# EAGLE design XMICRO-MEMORY V1.0 (EAGLE 6.3)
PROJECT_NAME: XMICRO-MEMORY; PROJECT_REVISION: 1.0

## Sheet 1 of 3: Bus Interface
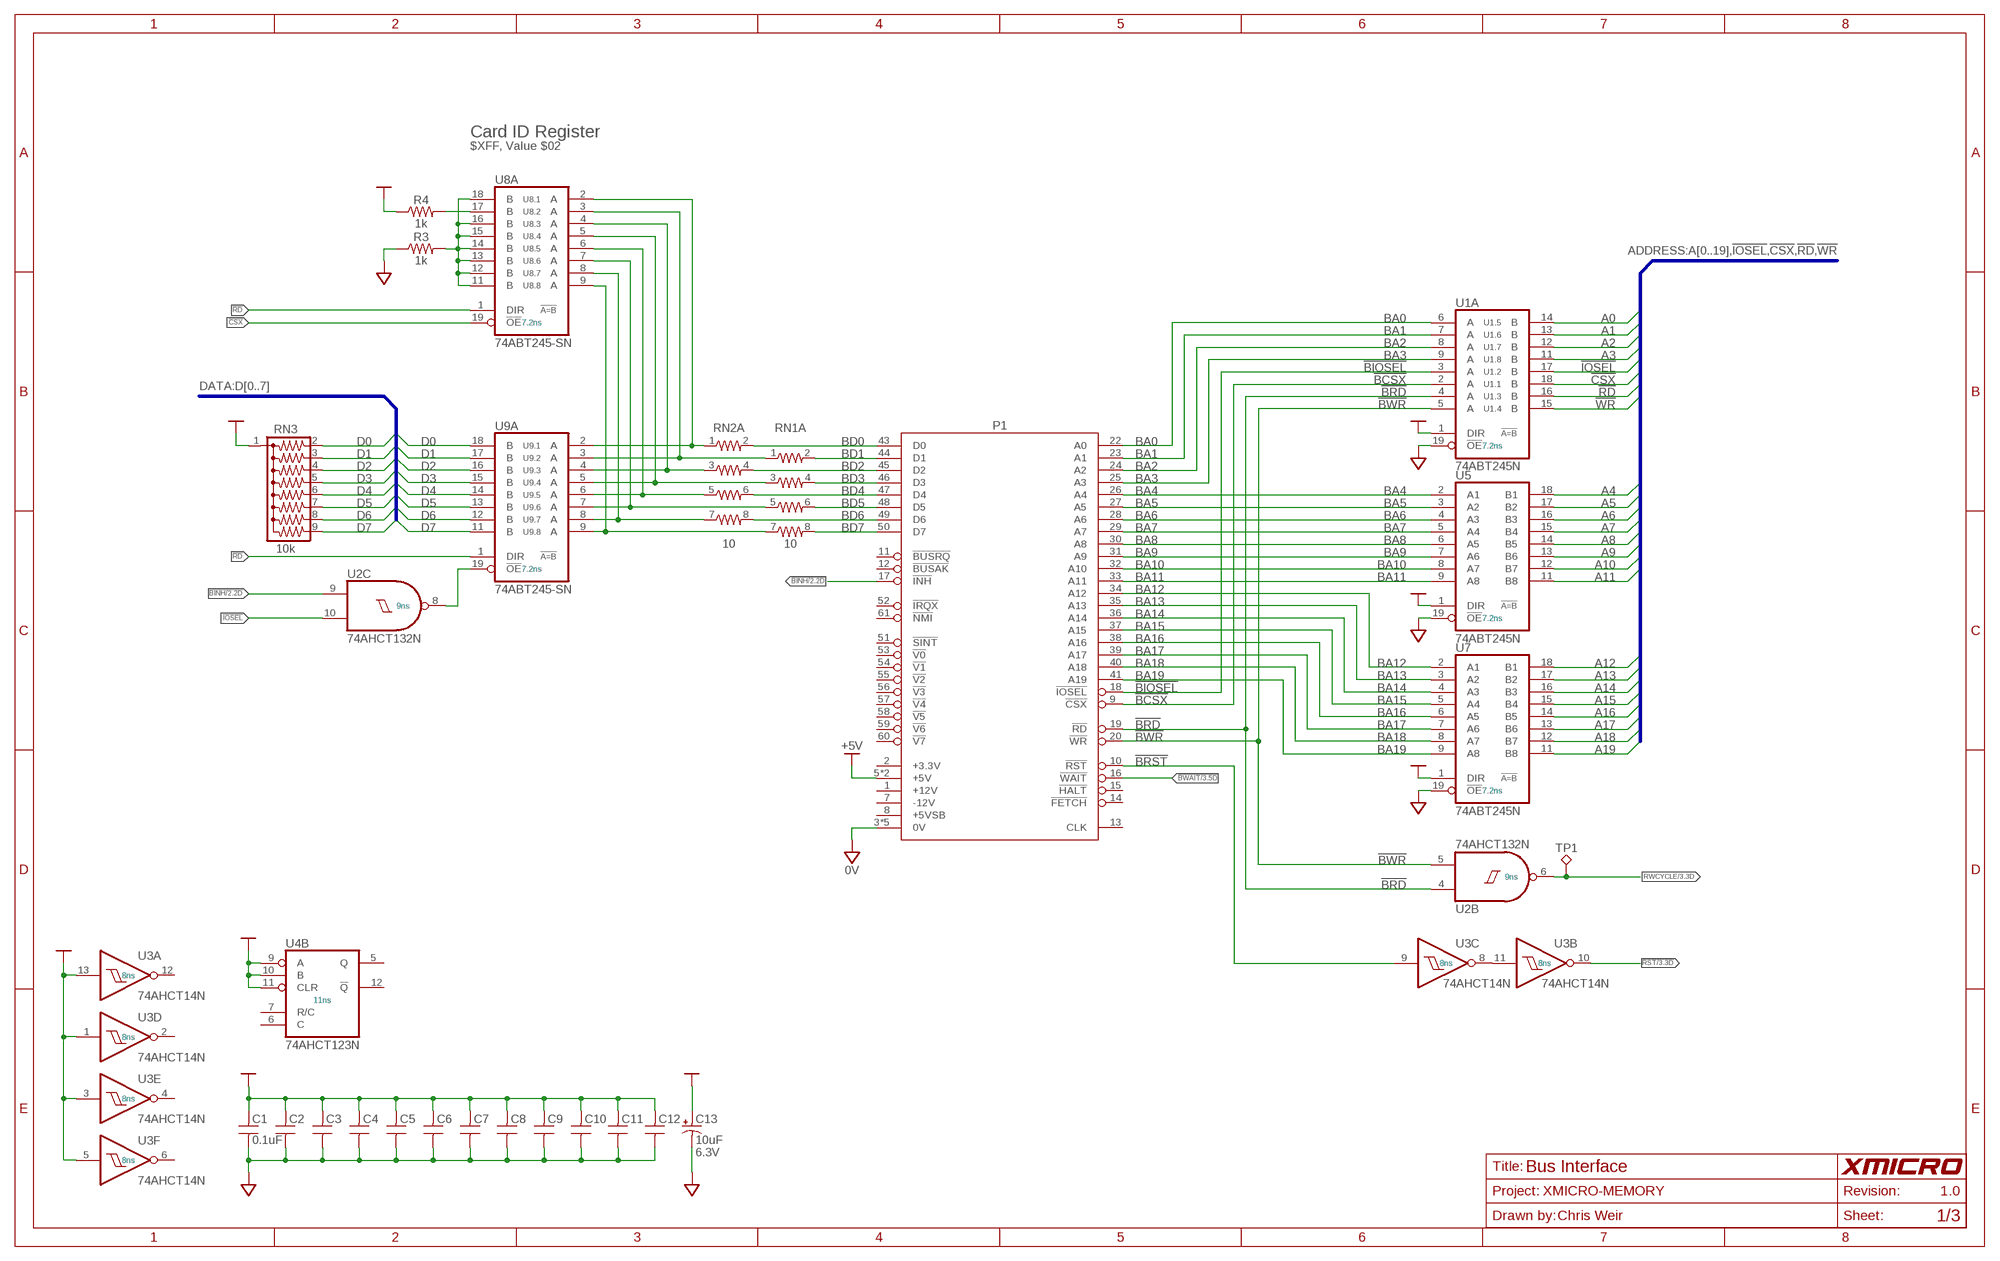
[diagram p0: schematic, sheet 1]
FRAME1 (11X17): DRAWN_BY: Chris Weir; SHEET_TITLE: Bus Interface

### Parts
C1  0.1uF  C-US025-024X044  [C025-024X044]
C2  0.1uF  C-US025-024X044  [C025-024X044]
C3  0.1uF  C-US025-024X044  [C025-024X044]
C4  0.1uF  C-US025-024X044  [C025-024X044]
C5  0.1uF  C-US025-024X044  [C025-024X044]
C6  0.1uF  C-US025-024X044  [C025-024X044]
C7  0.1uF  C-US025-024X044  [C025-024X044]
C8  0.1uF  C-US025-024X044  [C025-024X044]
C9  0.1uF  C-US025-024X044  [C025-024X044]
C10  0.1uF  C-US025-024X044  [C025-024X044]
C11  0.1uF  C-US025-024X044  [C025-024X044]
C12  0.1uF  C-US025-024X044  [C025-024X044]
C13  10uF  CPOL-USE2.5-6  [E2,5-6]
P1  XMICRO-BUS-EDGE  [EDGE62M]
R3  1k  R-US_0207/10  [0207/10]
R4  1k  R-US_0207/10  [0207/10]
RN1  10  E4R  [SIL8]
RN2  10  E4R  [SIL8]
RN3  10k  G08R  [SIL9]
TP1  TP-040  [TP-040]
U1  74ABT245N  74ABT245-SN  [DIL20]
U2  74AHCT132N  [DIL14]
U3  74AHCT14N  [DIL14]
U4  74AHCT123N  [DIL16]
U5  74ABT245N  [DIL20]
U7  74ABT245N  [DIL20]
U8  74ABT245-SN  [DIL20]
U9  74ABT245-SN  [DIL20]

### Nets
0V [0V]: C1.2 C2.2 C3.2 C4.2 C5.2 C6.2 C7.2 C8.2 C9.2 C10.2 C11.2 C12.2 C13.- P1.3(0V) P1.4(0V) P1.21(0V) P1.42(0V) P1.62(0V) R3.1 U1.19(A:!OE) U5.19(!OE) U7.19(!OE) ; also sheet 2,3
!BCSX: P1.9(!CSX) U1.2(.1:A)
!BINH: P1.17(!INH) U2.9(C:I0) ; also sheet 2,3
!BIOSEL: P1.18(!IOSEL) U1.3(.2:A)
!BRD: P1.19(!RD) U1.4(.3:A) U2.4(B:I0)
!BRST: P1.10(!RST) U3.9(C:I)
!BWAIT: P1.16(!WAIT) ; also sheet 3
!BWR: P1.20(!WR) U1.5(.4:A) U2.5(B:I1)
!CSX: U1.18(.1:B) U8.19(A:!OE)
!IOSEL: U1.17(.2:B) U2.10(C:I1) ; also sheet 2,3
!RD: U1.16(.3:B) U8.1(A:DIR) U9.1(A:DIR) ; also sheet 2,3
!RST: U3.10(B:O) ; also sheet 3
!WR: U1.15(.4:B) ; also sheet 2
+5V [SUPPLY]: C1.1 C2.1 C3.1 C4.1 C5.1 C6.1 C7.1 C8.1 C9.1 C10.1 C11.1 C12.1 C13.+ P1.5(+5V) P1.6(+5V) R4.1 RN3.1 U1.1(A:DIR) U3.1(D:I) U3.3(E:I) U3.5(F:I) U3.13(A:I) U4.9(B:A) U4.10(B:B) U4.11(B:CLR) U5.1(DIR) U7.1(DIR) ; also sheet 2,3
A0: U1.14(.5:B) ; also sheet 2,3
A1: U1.13(.6:B) ; also sheet 2,3
A2: U1.12(.7:B) ; also sheet 2,3
A3: U1.11(.8:B) ; also sheet 2,3
A4: U5.18(B1) ; also sheet 2,3
A5: U5.17(B2) ; also sheet 2,3
A6: U5.16(B3) ; also sheet 2,3
A7: U5.15(B4) ; also sheet 2,3
A8: U5.14(B5) ; also sheet 2,3
A9: U5.13(B6) ; also sheet 2,3
A10: U5.12(B7) ; also sheet 2,3
A11: U5.11(B8) ; also sheet 2,3
A12: U7.18(B1) ; also sheet 2,3
A13: U7.17(B2) ; also sheet 2,3
A14: U7.16(B3) ; also sheet 2,3
A15: U7.15(B4) ; also sheet 2,3
A16: U7.14(B5) ; also sheet 2,3
A17: U7.13(B6) ; also sheet 2,3
A18: U7.12(B7) ; also sheet 2,3
A19: U7.11(B8) ; also sheet 2,3
BA0: P1.22(A0) U1.6(.5:A)
BA1: P1.23(A1) U1.7(.6:A)
BA2: P1.24(A2) U1.8(.7:A)
BA3: P1.25(A3) U1.9(.8:A)
BA4: P1.26(A4) U5.2(A1)
BA5: P1.27(A5) U5.3(A2)
BA6: P1.28(A6) U5.4(A3)
BA7: P1.29(A7) U5.5(A4)
BA8: P1.30(A8) U5.6(A5)
BA9: P1.31(A9) U5.7(A6)
BA10: P1.32(A10) U5.8(A7)
BA11: P1.33(A11) U5.9(A8)
BA12: P1.34(A12) U7.2(A1)
BA13: P1.35(A13) U7.3(A2)
BA14: P1.36(A14) U7.4(A3)
BA15: P1.37(A15) U7.5(A4)
BA16: P1.38(A16) U7.6(A5)
BA17: P1.39(A17) U7.7(A6)
BA18: P1.40(A18) U7.8(A7)
BA19: P1.41(A19) U7.9(A8)
BD0: P1.43(D0) RN2.2
BD1: P1.44(D1) RN1.2
BD2: P1.45(D2) RN2.4
BD3: P1.46(D3) RN1.4
BD4: P1.47(D4) RN2.6
BD5: P1.48(D5) RN1.6
BD6: P1.49(D6) RN2.8
BD7: P1.50(D7) RN1.8
D0: RN3.2 U9.18(.1:B) ; also sheet 2,3
D1: RN3.3 U9.17(.2:B) ; also sheet 2,3
D2: RN3.4 U9.16(.3:B) ; also sheet 2,3
D3: RN3.5 U9.15(.4:B) ; also sheet 2,3
D4: RN3.6 U9.14(.5:B) ; also sheet 2,3
D5: RN3.7 U9.13(.6:B) ; also sheet 2,3
D6: RN3.8 U9.12(.7:B) ; also sheet 2,3
D7: RN3.9 U9.11(.8:B) ; also sheet 2,3
N$1 [0V]: R3.2 U8.11(.8:B) U8.12(.7:B) U8.13(.6:B) U8.14(.5:B) U8.15(.4:B) U8.16(.3:B) U8.18(.1:B)
N$2 [SUPPLY]: R4.2 U8.17(.2:B)
N$16: U3.8(C:O) U3.11(B:I)
N$32: U2.8(C:O) U9.19(A:!OE)
N$37: RN2.1 U8.2(.1:A) U9.2(.1:A)
N$38: RN1.1 U8.3(.2:A) U9.3(.2:A)
N$39: RN2.3 U8.4(.3:A) U9.4(.3:A)
N$40: RN1.3 U8.5(.4:A) U9.5(.4:A)
N$41: RN2.5 U8.6(.5:A) U9.6(.5:A)
N$42: RN1.5 U8.7(.6:A) U9.7(.6:A)
N$43: RN2.7 U8.8(.7:A) U9.8(.7:A)
N$44: RN1.7 U8.9(.8:A) U9.9(.8:A)
RWCYCLE: TP1.1 U2.6(B:O) ; also sheet 3
Unconnected: P1.1(+12V) P1.2(+3.3V) P1.7(-12V) P1.8(+5VSB) P1.11(!BUSRQ) P1.12(!BUSAK) P1.13(CLK) P1.14(!FETCH) P1.15(!HALT) P1.51(!SINT) P1.52(!IRQX) P1.53(!V0) P1.54(!V1) P1.55(!V2) P1.56(!V3) P1.57(!V4) P1.58(!V5) P1.59(!V6) P1.60(!V7) P1.61(!NMI) U3.2(D:O) U3.4(E:O) U3.6(F:O) U3.12(A:O) U4.5(B:Q) U4.6(B:C) U4.7(B:R/C) U4.12(B:!Q)

### Buses
DATA:D[0..7]
ADDRESS:A[0..19],!IOSEL,!CSX,!RD,!WR

### Notes on the sheet
- Card ID Register
- $XFF, Value $02

## Sheet 2 of 3: RAM
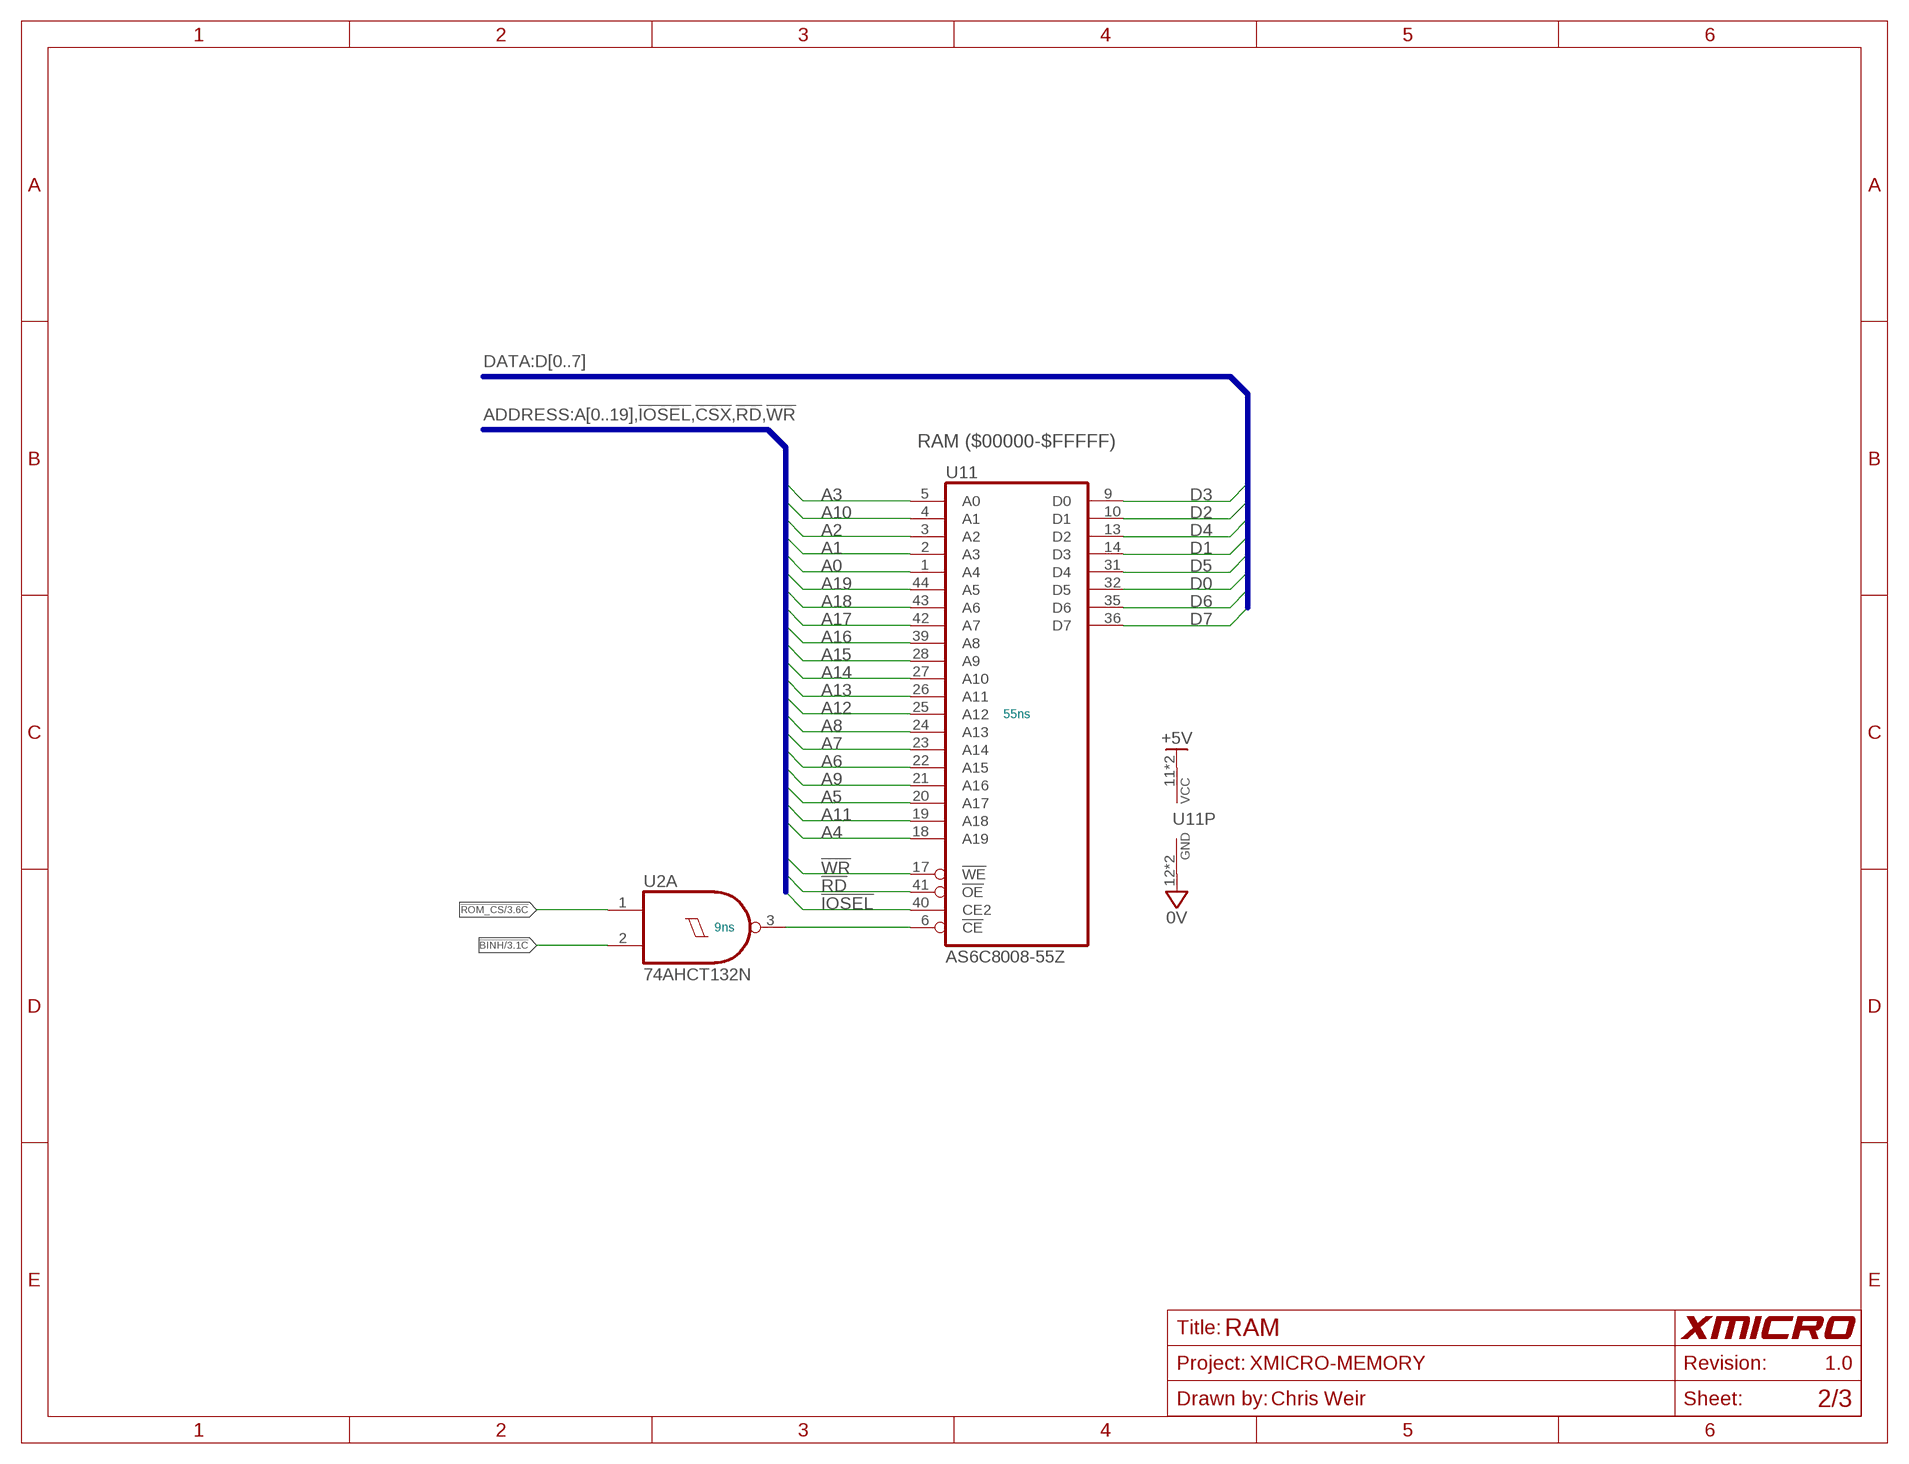
[diagram p1: schematic, sheet 2]
FRAME2 (LETTER): DRAWN_BY: Chris Weir; SHEET_TITLE: RAM

### Parts
U11  AS6C8008-55Z  [TSOP44-II]

### Nets
0V [0V]: U11.12(0V) U11.34(0V) ; also sheet 1,3
!BINH: U2.2(A:I1) ; also sheet 1,3
!IOSEL: U11.40(CE2) ; also sheet 1,3
!RD: U11.41(!OE) ; also sheet 1,3
!ROM_CS: U2.1(A:I0) ; also sheet 3
!WR: U11.17(!WE) ; also sheet 1
+5V [SUPPLY]: U11.11(+5V) U11.33(+5V) ; also sheet 1,3
A0: U11.1(A4) ; also sheet 1,3
A1: U11.2(A3) ; also sheet 1,3
A2: U11.3(A2) ; also sheet 1,3
A3: U11.5(A0) ; also sheet 1,3
A4: U11.18(A19) ; also sheet 1,3
A5: U11.20(A17) ; also sheet 1,3
A6: U11.22(A15) ; also sheet 1,3
A7: U11.23(A14) ; also sheet 1,3
A8: U11.24(A13) ; also sheet 1,3
A9: U11.21(A16) ; also sheet 1,3
A10: U11.4(A1) ; also sheet 1,3
A11: U11.19(A18) ; also sheet 1,3
A12: U11.25(A12) ; also sheet 1,3
A13: U11.26(A11) ; also sheet 1,3
A14: U11.27(A10) ; also sheet 1,3
A15: U11.28(A9) ; also sheet 1,3
A16: U11.39(A8) ; also sheet 1,3
A17: U11.42(A7) ; also sheet 1,3
A18: U11.43(A6) ; also sheet 1,3
A19: U11.44(A5) ; also sheet 1,3
D0: U11.32(D5) ; also sheet 1,3
D1: U11.14(D3) ; also sheet 1,3
D2: U11.10(D1) ; also sheet 1,3
D3: U11.9(D0) ; also sheet 1,3
D4: U11.13(D2) ; also sheet 1,3
D5: U11.31(D4) ; also sheet 1,3
D6: U11.35(D6) ; also sheet 1,3
D7: U11.36(D7) ; also sheet 1,3
N$45: U2.3(A:O) U11.6(!CE)

### Buses
DATA:D[0..7]
ADDRESS:A[0..19],!IOSEL,!CSX,!RD,!WR

### Notes on the sheet
- RAM ($00000-$FFFFF)

## Sheet 3 of 3: ROM
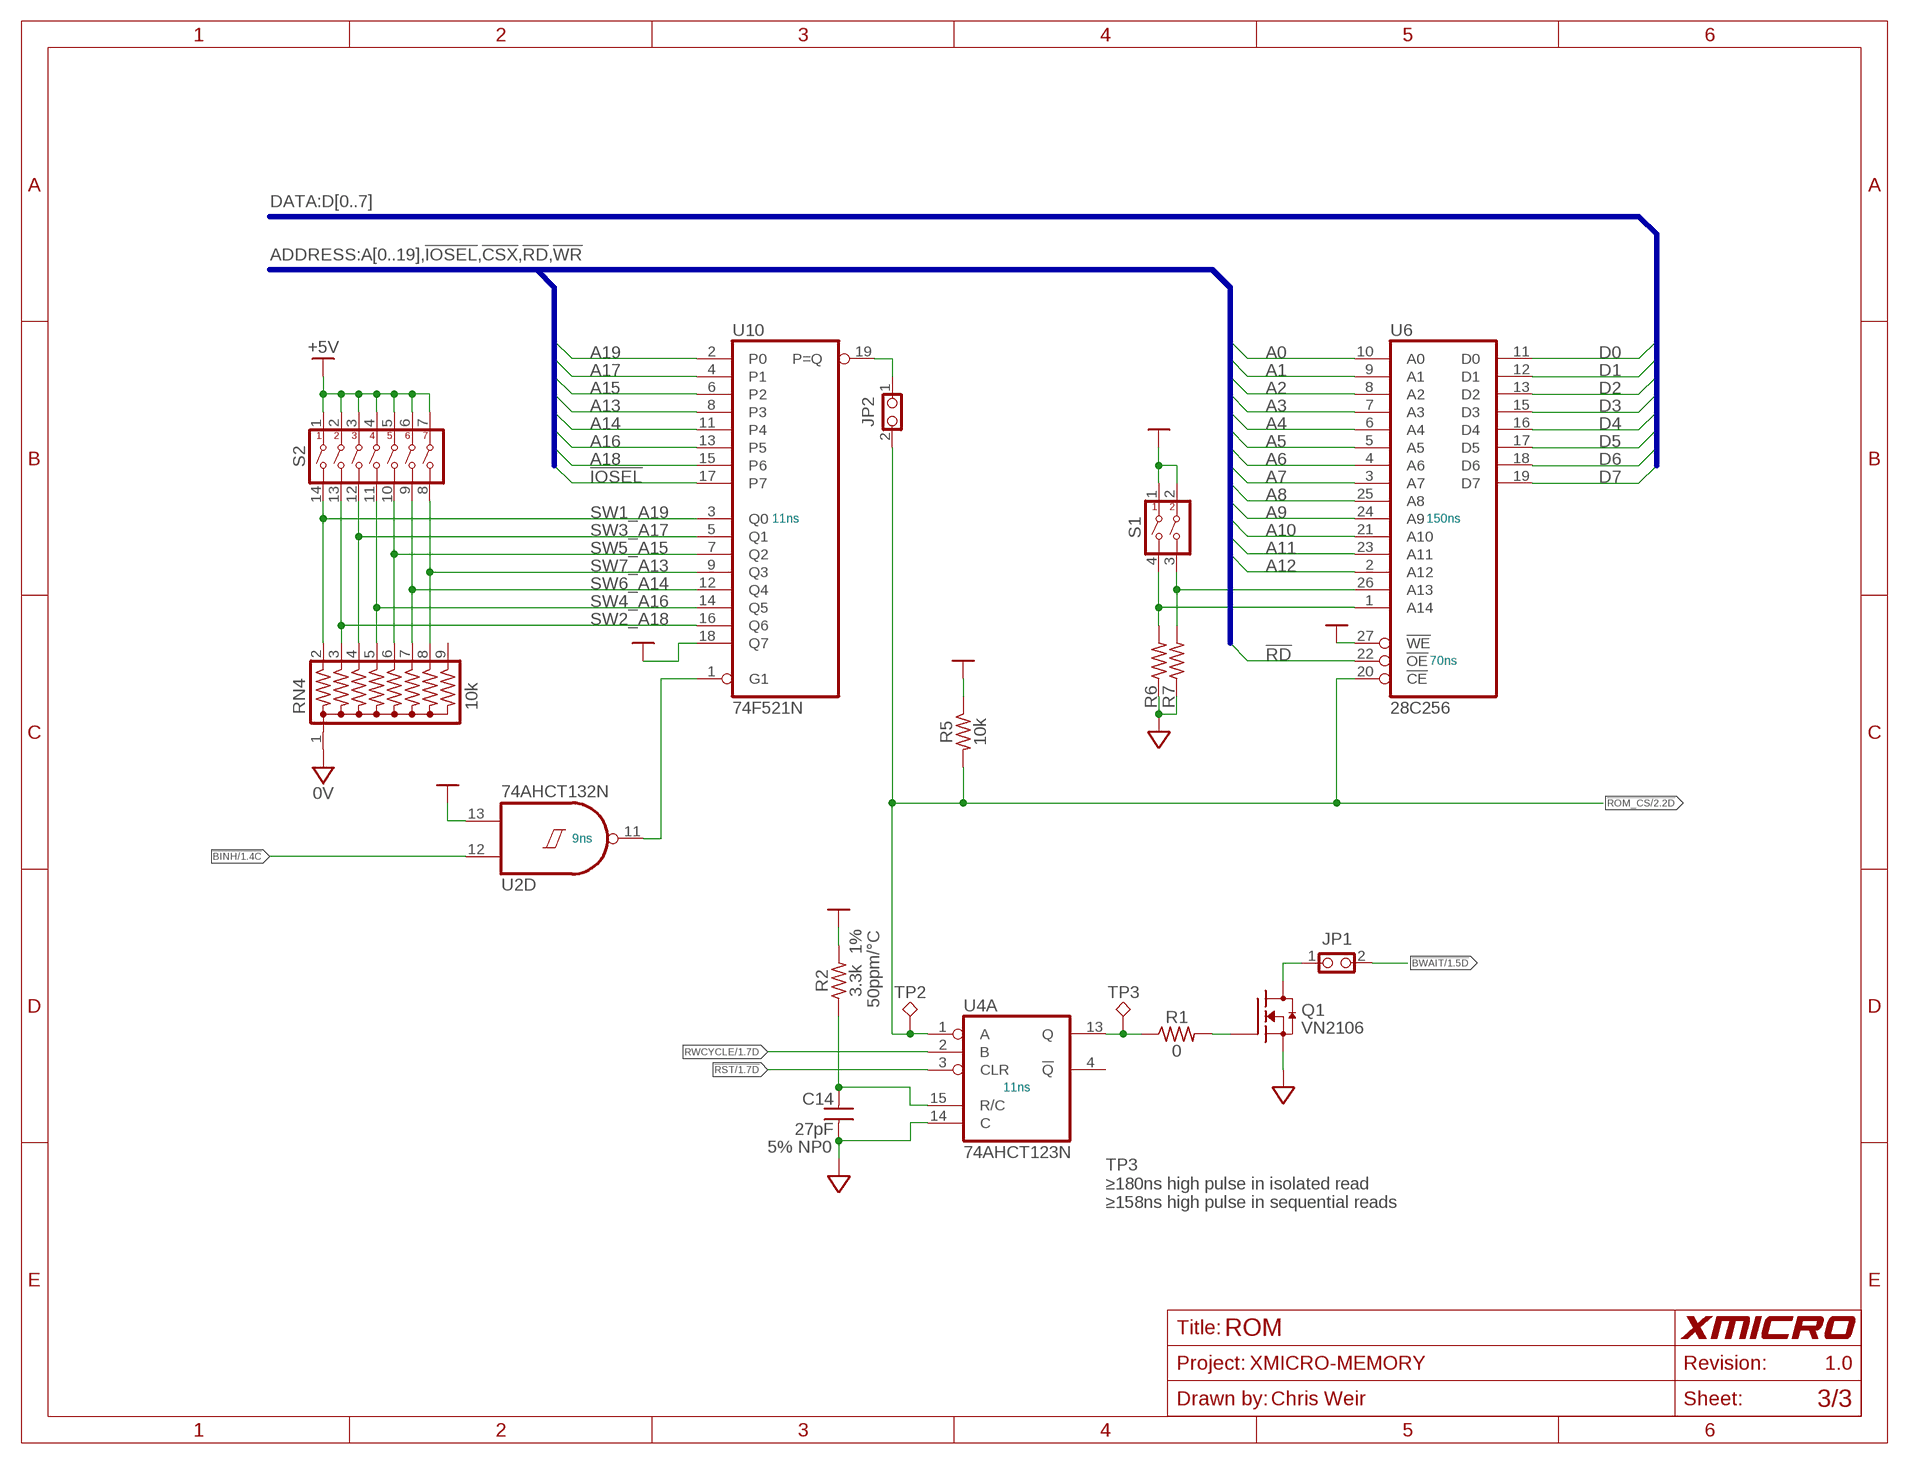
[diagram p2: schematic, sheet 3]
FRAME3 (LETTER): DRAWN_BY: Chris Weir; SHEET_TITLE: ROM

### Parts
C14  27pF  C-US025-024X044  [C025-024X044]
JP1  1X2-THRU  [1X2]
JP2  1X2-THRU  [1X2]
Q1  VN2106  [TO92]
R1  0  R-US_0207/10  [0207/10]
R2  3.3k  R-US_0207/10  [0207/10]
R5  10k  R-US_0207/10  [0207/10]
R6  10k  R-US_0207/10  [0207/10]
R7  10k  R-US_0207/10  [0207/10]
RN4  10k  G08R  [SIL9]
S1  SW-DIP02  [SW-DIP2]
S2  SW-DIP07  [SW-DIP7]
TP2  TP-040  [TP-040]
TP3  TP-040  [TP-040]
U6  28C256  28C256-P-Z  [228-1277-00]
U10  74F521N  [DIL20]

### Nets
0V [0V]: C14.2 Q1.1(S) R6.1 R7.1 RN4.1 U4.14(A:C) ; also sheet 1,2
!BINH: U2.12(D:I0) ; also sheet 1,2
!BWAIT: JP1.2 ; also sheet 1
!IOSEL: U10.17(P7) ; also sheet 1,2
!RD: U6.22(!OE) ; also sheet 1,2
!ROM_CS: JP2.2 R5.2 TP2.1 U4.1(A:A) U6.20(!CE) ; also sheet 2
!RST: U4.3(A:CLR) ; also sheet 1
+5V [SUPPLY]: R2.2 R5.1 S1.1 S1.2 S2.1 S2.2 S2.3 S2.4 S2.5 S2.6 S2.7 U2.13(D:I1) U6.27(!WE) U10.18(Q7) ; also sheet 1,2
A0: U6.10(A0) ; also sheet 1,2
A1: U6.9(A1) ; also sheet 1,2
A2: U6.8(A2) ; also sheet 1,2
A3: U6.7(A3) ; also sheet 1,2
A4: U6.6(A4) ; also sheet 1,2
A5: U6.5(A5) ; also sheet 1,2
A6: U6.4(A6) ; also sheet 1,2
A7: U6.3(A7) ; also sheet 1,2
A8: U6.25(A8) ; also sheet 1,2
A9: U6.24(A9) ; also sheet 1,2
A10: U6.21(A10) ; also sheet 1,2
A11: U6.23(A11) ; also sheet 1,2
A12: U6.2(A12) ; also sheet 1,2
A13: U10.8(P3) ; also sheet 1,2
A14: U10.11(P4) ; also sheet 1,2
A15: U10.6(P2) ; also sheet 1,2
A16: U10.13(P5) ; also sheet 1,2
A17: U10.4(P1) ; also sheet 1,2
A18: U10.15(P6) ; also sheet 1,2
A19: U10.2(P0) ; also sheet 1,2
D0: U6.11(D0) ; also sheet 1,2
D1: U6.12(D1) ; also sheet 1,2
D2: U6.13(D2) ; also sheet 1,2
D3: U6.15(D3) ; also sheet 1,2
D4: U6.16(D4) ; also sheet 1,2
D5: U6.17(D5) ; also sheet 1,2
D6: U6.18(D6) ; also sheet 1,2
D7: U6.19(D7) ; also sheet 1,2
N$5: JP2.1 U10.19(P=Q)
N$6: Q1.2(G) R1.2
N$9: JP1.1 Q1.3(D)
N$12: R7.2 S1.3 U6.26(A13)
N$17: R6.2 S1.4 U6.1(A14)
N$27: U2.11(D:O) U10.1(G1)
N$31: C14.1 R2.1 U4.15(A:R/C)
RWCYCLE: U4.2(A:B) ; also sheet 1
SW1_A19: RN4.2 S2.14 U10.3(Q0)
SW2_A18: RN4.3 S2.13 U10.16(Q6)
SW3_A17: RN4.4 S2.12 U10.5(Q1)
SW4_A16: RN4.5 S2.11 U10.14(Q5)
SW5_A15: RN4.6 S2.10 U10.7(Q2)
SW6_A14: RN4.7 S2.9 U10.12(Q4)
SW7_A13: RN4.8 S2.8 U10.9(Q3)
WAIT_ROM: R1.1 TP3.1 U4.13(A:Q)
Unconnected: RN4.9 U4.4(A:!Q)

### Buses
DATA:D[0..7]
ADDRESS:A[0..19],!IOSEL,!CSX,!RD,!WR

### Notes on the sheet
- TP3
  ≥180ns high pulse in isolated read
  ≥158ns high pulse in sequential reads

## Power pins joined to a net without a drawn wire
0V: U1.10(P:0V) U2.7(P:0V) U3.7(P:0V) U4.8(P:0V) U5.10(0V) U6.14(0V) U7.10(0V) U8.10(P:0V) U9.10(P:0V) U10.10(0V)
+5V: U1.20(P:+5V) U2.14(P:+5V) U3.14(P:+5V) U4.16(P:+5V) U5.20(+5V) U6.28(+5V) U7.20(+5V) U8.20(P:+5V) U9.20(P:+5V) U10.20(+5V)

## Library data of the parts
C1-C12 = rcl:C-US: CAPACITOR, American symbol
C13 = rcl:CPOL-US: POLARIZED CAPACITOR, American symbol; VOLTAGE: 6.3V
C14 = rcl:C-US: CAPACITOR, American symbol; TC: NP0; TOLERANCE: 5%
JP1 JP2 = header:1X2-THRU
P1 = xmicro:XMICRO-BUS: XMICRO Bus Symbol with logical pin arrangement
Q1 = transistor-misc:VN2106
R1 R3-R7 = rcl:R-US_: RESISTOR, American symbol
R2 = rcl:R-US_: RESISTOR, American symbol; TC: 50ppm/°C; TOLERANCE: 1%
RN1 RN2 = resistor-sil:E4R: SIL RESISTOR; OC_FARNELL: unknown; OC_NEWARK: unknown
RN3 RN4 = resistor-sil:G08R: SIL RESISTOR; OC_FARNELL: unknown; OC_NEWARK: unknown
S1 = switch-misc:SW-DIP02
S2 = switch-misc:SW-DIP07
TP1-TP3 = header:TP: Test Point
U1 U8 U9 = 74xx-us:74*245-S: Octal BUS TRANSCEIVER, 3-state; TPD: 7.2ns
U2 = 74xx-us:74*132: Quad 2-input NAND schmitt trigger; TPD: 9ns
U3 = 74xx-us:74*14: Hex schmitt trigger INVERTER; TPD: 8ns
U4 = 74xx-us:74*123: Retriggerable monostable MULTIVIBRATOR; TPD: 11ns
U5 U7 = 74xx-us:74*245: Octal BUS TRANSCEIVER, 3-state; TPD: 7.2ns
U6 = ic-misc:28*256: 28C256 Parallel EEPROM; TACC: 150ns; TOE: 70ns
U10 = 74xx-us:74*521; TPD: 11ns
U11 = ic-misc:AS6C8008; TPD: 55ns

## Net classes
1 0V: width 0.254 mm, clearance 0.305 mm
2 SUPPLY: width 0.254 mm, drill 0.483 mm, clearance 0.305 mm
3 CHASSIS: clearance 0.762 mm

## Board
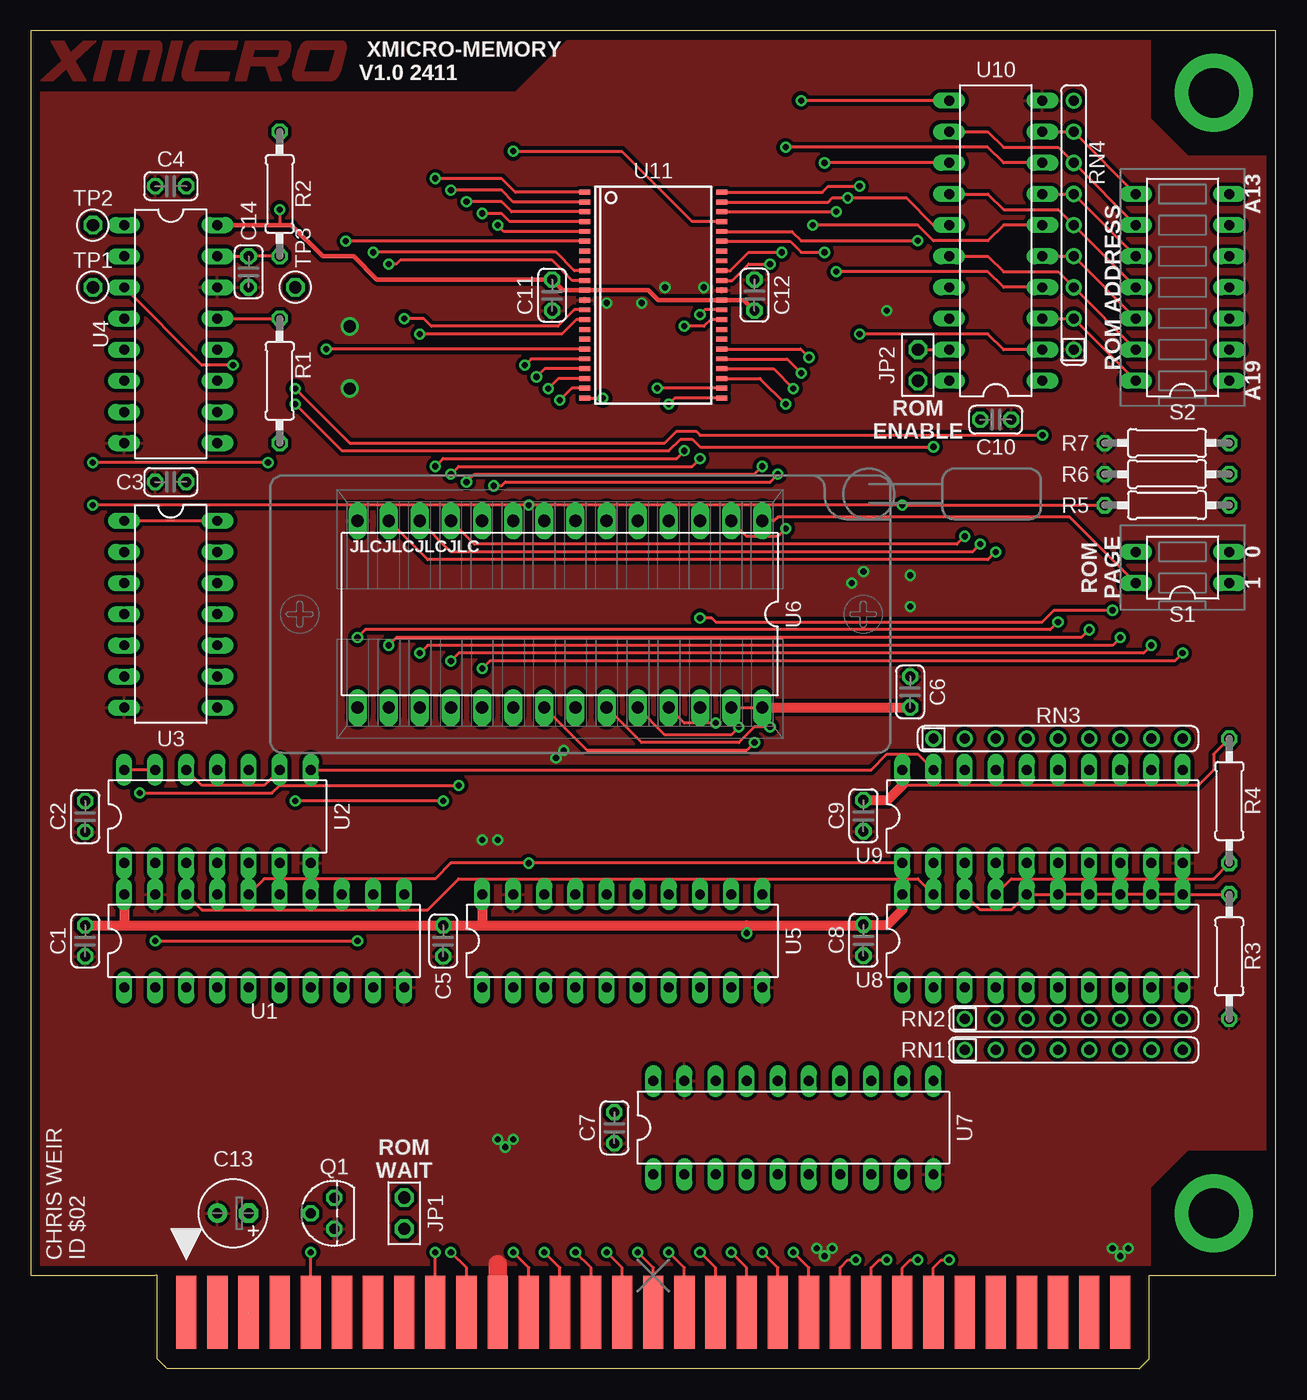
[diagram p3: board, top side]
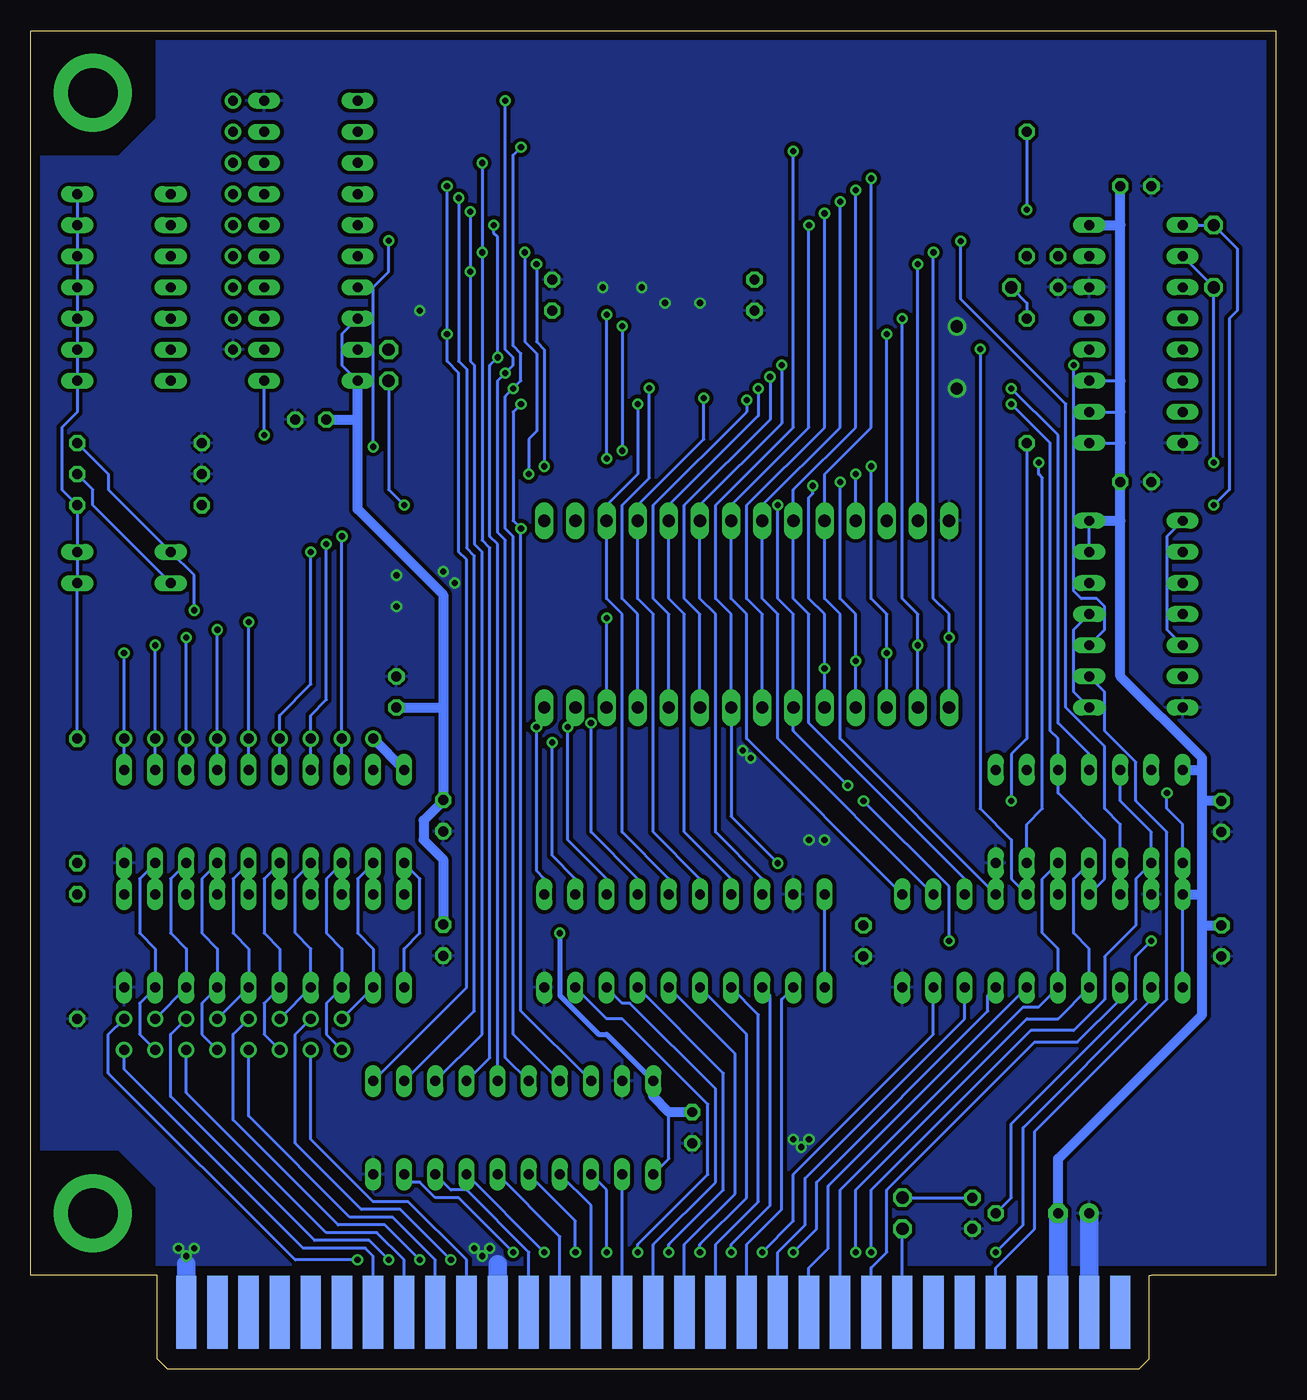
[diagram p4: board, bottom side, seen from below]

Size 101.6 x 109.22 mm. Coordinates in mm from the lower left corner, seen from the top.
Outline: 10.16,7.62 0,7.62 0,109.22 101.6,109.22 101.6,7.62 91.44,7.62
Copper layers (1*16): Top 0.035mm / dielectric 1.5mm / Bottom 0.035mm
Design rules "JLCPCB Standard": minimum track width 5mil, minimum drill 0.3mm, track to track 5mil, track to pad 8mil, pad to pad 8mil, via to via 8mil, smd to smd 5mil, copper to edge 30mil, drill to drill 0.26mm, minimum pad ring 10mil, minimum via ring 8mil, stop-mask expansion 3mil, vias tented up to drill 25mil, thermal gap 10mil
tKeepout: area 0,107.6 to 101.6,109.2
bKeepout: area 0,107.6 to 101.6,109.2
tRestrict: area 91.4,99.1 to 101.6,109.2; area 10.3,0 to 91.3,8.4; area 91.3,7.6 to 101.6,17.8; 4 lines
bRestrict: area 91.3,7.6 to 101.6,17.8; area 91.4,99.1 to 101.6,109.2; area 10.3,0 to 91.3,8.4

### Footprints (pad centres in the part's own frame; a part is rotated, then mirrored left to right if it is on the bottom)
C025-024X044 = drill 0.813 octagon: 1 -1.27,0; 2 1.27,0
E2,5-6 = drill 0.813 pad 1.6 octagon: + -1.27,0 | drill 0.813 pad 1.6: - 1.27,0
1X2 = drill 1.016 octagon: 1 -1.27,0; 2 1.27,0
EDGE62M = smd 1.651 x 5.969: 1 -38.1,-3.01; 3 -35.56,-3.01; 5 -33.02,-3.01; 7 -30.48,-3.01; 9 -27.94,-3.01; 11 -25.4,-3.01; 13 -22.86,-3.01; 15 -20.32,-3.01; 17 -17.78,-3.01; 19 -15.24,-3.01; 21 -12.7,-3.01; 23 -10.16,-3.01; 25 -7.62,-3.01; 27 -5.08,-3.01; 29 -2.54,-3.01; 31 0,-3.01; 33 2.54,-3.01; 35 5.08,-3.01; 37 7.62,-3.01; 39 10.16,-3.01; 41 12.7,-3.01; 43 15.24,-3.01; 45 17.78,-3.01; 47 20.32,-3.01; 49 22.86,-3.01; 51 25.4,-3.01; 53 27.94,-3.01; 55 30.48,-3.01; 57 33.02,-3.01; 59 35.56,-3.01; 61 38.1,-3.01 | smd 1.651 x 5.969 bottom: 2 -38.1,-3.01; 4 -35.56,-3.01; 6 -33.02,-3.01; 8 -30.48,-3.01; 10 -27.94,-3.01; 12 -25.4,-3.01; 14 -22.86,-3.01; 16 -20.32,-3.01; 18 -17.78,-3.01; 20 -15.24,-3.01; 22 -12.7,-3.01; 24 -10.16,-3.01; 26 -7.62,-3.01; 28 -5.08,-3.01; 30 -2.54,-3.01; 32 0,-3.01; 34 2.54,-3.01; 36 5.08,-3.01; 38 7.62,-3.01; 40 10.16,-3.01; 42 12.7,-3.01; 44 15.24,-3.01; 46 17.78,-3.01; 48 20.32,-3.01; 50 22.86,-3.01; 52 25.4,-3.01; 54 27.94,-3.01; 56 30.48,-3.01; 58 33.02,-3.01; 60 35.56,-3.01; 62 38.1,-3.01
TO92 = drill 0.813 octagon: 1 -1.27,0; 2 0,1.905; 3 1.27,0
0207/10 = drill 0.813 octagon: 1 -5.08,0; 2 5.08,0
SIL8 = drill 0.813: 1 -8.89,0; 2 -6.35,0; 3 -3.81,0; 4 -1.27,0; 5 1.27,0; 6 3.81,0; 7 6.35,0; 8 8.89,0
SIL9 = drill 0.813: 1 -10.16,0; 2 -7.62,0; 3 -5.08,0; 4 -2.54,0; 5 0,0; 6 2.54,0; 7 5.08,0; 8 7.62,0; 9 10.16,0
SW-DIP2 = drill 0.813 long: 1 -1.27,-3.81; 2 1.27,-3.81; 3 1.27,3.81; 4 -1.27,3.81
SW-DIP7 = drill 0.813 long: 1 -7.62,-3.81; 2 -5.08,-3.81; 3 -2.54,-3.81; 4 0,-3.81; 5 2.54,-3.81; 6 5.08,-3.81; 7 7.62,-3.81; 8 7.62,3.81; 9 5.08,3.81; 10 2.54,3.81; 11 0,3.81; 12 -2.54,3.81; 13 -5.08,3.81; 14 -7.62,3.81
TP-040 = drill 1 octagon: 1 0,0
DIL20 = drill 0.813 long: 1 -11.43,-3.81; 2 -8.89,-3.81; 3 -6.35,-3.81; 4 -3.81,-3.81; 5 -1.27,-3.81; 6 1.27,-3.81; 7 3.81,-3.81; 8 6.35,-3.81; 9 8.89,-3.81; 10 11.43,-3.81; 11 11.43,3.81; 12 8.89,3.81; 13 6.35,3.81; 14 3.81,3.81; 15 1.27,3.81; 16 -1.27,3.81; 17 -3.81,3.81; 18 -6.35,3.81; 19 -8.89,3.81; 20 -11.43,3.81
DIL14 = drill 0.813 long: 1 -7.62,-3.81; 2 -5.08,-3.81; 3 -2.54,-3.81; 4 0,-3.81; 5 2.54,-3.81; 6 5.08,-3.81; 7 7.62,-3.81; 8 7.62,3.81; 9 5.08,3.81; 10 2.54,3.81; 11 0,3.81; 12 -2.54,3.81; 13 -5.08,3.81; 14 -7.62,3.81
DIL16 = drill 0.813 long: 1 -8.89,-3.81; 2 -6.35,-3.81; 3 -3.81,-3.81; 4 -1.27,-3.81; 5 1.27,-3.81; 6 3.81,-3.81; 7 6.35,-3.81; 8 8.89,-3.81; 9 8.89,3.81; 10 6.35,3.81; 11 3.81,3.81; 12 1.27,3.81; 13 -1.27,3.81; 14 -3.81,3.81; 15 -6.35,3.81; 16 -8.89,3.81
228-1277-00 = drill 1 long: 1 -16.51,-7.62; 2 -13.97,-7.62; 3 -11.43,-7.62; 4 -8.89,-7.62; 5 -6.35,-7.62; 6 -3.81,-7.62; 7 -1.27,-7.62; 8 1.27,-7.62; 9 3.81,-7.62; 10 6.35,-7.62; 11 8.89,-7.62; 12 11.43,-7.62; 13 13.97,-7.62; 14 16.51,-7.62; 15 16.51,7.62; 16 13.97,7.62; 17 11.43,7.62; 18 8.89,7.62; 19 6.35,7.62; 20 3.81,7.62; 21 1.27,7.62; 22 -1.27,7.62; 23 -3.81,7.62; 24 -6.35,7.62; 25 -8.89,7.62; 26 -11.43,7.62; 27 -13.97,7.62; 28 -16.51,7.62
TSOP44-II = smd 0.4 x 0.9: 1 -8.4,-5.6; 2 -7.6,-5.6; 3 -6.8,-5.6; 4 -6,-5.6; 5 -5.2,-5.6; 6 -4.4,-5.6; 7 -3.6,-5.6; 8 -2.8,-5.6; 9 -2,-5.6; 10 -1.2,-5.6; 11 -0.4,-5.6; 12 0.4,-5.6; 13 1.2,-5.6; 14 2,-5.6; 15 2.8,-5.6; 16 3.6,-5.6; 17 4.4,-5.6; 18 5.2,-5.6; 19 6,-5.6; 20 6.8,-5.6; 21 7.6,-5.6; 22 8.4,-5.6; 23 8.4,5.6; 24 7.6,5.6; 25 6.8,5.6; 26 6,5.6; 27 5.2,5.6; 28 4.4,5.6; 29 3.6,5.6; 30 2.8,5.6; 31 2,5.6; 32 1.2,5.6; 33 0.4,5.6; 34 -0.4,5.6; 35 -1.2,5.6; 36 -2,5.6; 37 -2.8,5.6; 38 -3.6,5.6; 39 -4.4,5.6; 40 -5.2,5.6; 41 -6,5.6; 42 -6.8,5.6; 43 -7.6,5.6; 44 -8.4,5.6

### Placement (x,y rotation side)
C1  4.45,34.92 270 top
C2  4.45,45.09 270 top
C3  11.43,72.39 180 top
C4  11.43,96.52 180 top
C5  33.66,34.92 270 top
C6  71.75,55.24 90 top
C7  47.62,19.68 270 top
C8  67.94,34.99 270 top
C9  67.94,45.15 270 top
C10  78.74,77.47 0 top
C11  42.55,87.63 270 top
C12  59.05,87.63 90 top
C13  16.51,12.7 180 top
C14  17.78,89.54 270 top
JP1  30.48,12.7 270 top
JP2  72.39,81.92 270 top
P1  50.8,7.62 0 top
Q1  24.77,12.7 90 top
R1  20.32,80.65 270 top
R2  20.32,95.89 90 top
R3  97.79,33.66 90 top
R4  97.79,46.35 270 top
R5  92.71,70.48 180 top
R6  92.71,73.03 0 top
R7  92.71,75.56 0 top
RN1  85.09,26.04 0 top
RN2  85.09,28.57 0 top
RN3  83.82,51.43 0 top
RN4  85.09,93.34 90 top
S1  93.98,65.41 90 top
S2  93.98,88.27 90 top
TP1  5.08,88.27 0 top
TP2  5.08,93.34 0 top
TP3  21.59,88.27 270 top
U1  19.05,34.92 0 top
U2  15.24,45.09 0 top
U3  11.43,61.59 270 top
U4  11.43,84.45 270 top
U5  48.26,34.92 0 top
U6  43.18,61.59 180 top
U7  62.23,19.68 0 top
U8  82.55,34.92 0 top
U9  82.55,45.09 0 top
U10  78.74,92.08 90 top
U11  50.8,87.63 270 top

### Tracks (layer width: path | path; a pad name or v marks a point on that pad's centre or on a via)
0V  (via drill 0.5, 1)  (1 unrouted)
  Top 1.524: P1.21 38.1,8.54
  Bottom 1.524: P1.4 C13.- | P1.42 63.5,8.54 | P1.62 88.9,8.54
  other vias: 64.77,9.21 65.41,9.84 64.14,9.84 88.9,9.21 89.53,9.84 88.27,9.84 54.93,88.27 46.99,87 38.73,18.1 39.37,18.73 38.1,18.73 36.83,43.18 38.1,43.18 49.85,87 51.75,88.27 69.85,86.36 71.75,64.77 71.75,62.23 42.86,49.85 43.5,50.48 66.99,64.14 67.94,65.09 26.04,85.09 26.04,80.01
  pour Bottom (rank 3): 0,109.22 101.6,109.22 101.6,7.62 0,7.62
  pour Top (rank 3): 0,109.22 101.6,109.22 101.6,7.62 0,7.62
!BCSX  (via drill 0.5)
  Top 0.254: P1.9 v22.86,9.53
  Bottom 0.254: v22.86,9.53 20.64,11.75 20.64,19.68 10.16,30.16 U1.2
!BINH  (via drill 0.5)
  Top 0.254: P1.17 v33.02,9.53 | U2.9 19.05,47.62 13.97,47.62 U2.12
  Bottom 0.254: v33.02,9.53 33.02,14.61 20,27.62 16.51,27.62 13.97,30.16 13.97,33.66 11.43,36.2 11.43,40 U2.2 10.16,43.81 12.7,46.35 U2.12
!BIOSEL
  Bottom 0.254: P1.18 33.02,8.26 31.75,9.53 31.75,14.61 19.68,26.67 16.19,26.67 12.7,30.16 U1.3
!BRD  (via drill 0.5)
  Top 0.254: P1.19 35.56,8.26 v34.29,9.53
  Bottom 0.254: v34.29,9.53 34.29,14.61 20.32,28.57 17.78,28.57 U1.4 15.24,34.29 16.51,35.56 16.51,40 U2.4
!BRST
  Bottom 0.254: P1.10 22.86,8.26 19.68,11.43 19.68,19.37 8.89,30.16 8.89,43.81 11.43,46.35 11.43,49.53 13.97,52.07 13.97,55.24 U3.9
!BWAIT
  Bottom 0.254: P1.16 JP1.2
!BWR
  Bottom 0.254: P1.20 35.56,14.61 20.64,29.53 19.37,29.53 U1.5 17.78,34.29 19.05,35.56 19.05,40 U2.5
!CSX
  Top 0.254: U1.18 13.97,37.46 32.38,37.46 34.92,40 72.39,40 U8.19
!IOSEL  (via drill 0.5)
  Top 0.254: v21.59,78.74 25.4,74.93 52.07,74.93 53.02,75.88 53.98,75.88 54.61,75.25 v73.66,75.25 | U11.40 62.11,92.83 62.87,92.08 v72.39,92.08
  Bottom 0.254: U1.17 13.97,40 13.97,43.18 17.78,46.99 U2.10 17.78,51.43 18.41,52.07 18.41,75.56 v21.59,78.74 | v73.66,75.25 73.66,88.27 | 73.66,88.27 72.39,89.54 v72.39,92.08 | U10.17 73.66,88.27
!RD  (via drill 0.5)
  Top 0.254: U9.1 v40.64,41.27 34.29,41.27 33.02,40 19.05,40 U1.16 | v39.37,99.38 48.23,99.38 53.98,93.63 U11.41
  Bottom 0.254: U8.1 71.12,34.29 69.85,35.56 69.85,40 U9.1 | v40.64,41.27 44.45,45.09 U6.22 44.45,61.59 45.72,62.86 45.72,70.48 39.37,76.84 v39.37,99.38
!ROM_CS  (via drill 0.5)
  Top 0.254: v8.89,46.99 19.68,46.99 20.32,47.62 v34.92,47.62 | R5.2 v71.12,70.48 v40.64,70.48 v5.08,70.48
  Bottom 0.254: U2.1 7.62,44.45 8.89,45.72 v8.89,46.99 | v34.92,47.62 39.37,52.07 U6.20 39.37,61.59 40.64,62.86 v40.64,70.48 | U4.1 TP2.1 3.17,91.44 3.17,86.36 3.81,85.73 3.81,71.76 v5.08,70.48 | JP2.2 72.39,71.76 v71.12,70.48
!RST  (via drill 0.5)
  Top 0.254: v16.51,81.92 13.97,81.92 U4.3
  Bottom 0.254: U3.10 13.97,60.32 13.97,62.23 14.61,62.86 15.88,62.86 16.51,63.5 v16.51,81.92
!WR  (via drill 0.5)
  Top 0.254: U11.17 v24.13,83.23
  Bottom 0.254: v24.13,83.23 24.13,45.72 21.59,43.18 21.59,40 U1.15
+5V  (via drill 0.5)  (1 unrouted)
  Top 0.254: R4.1 96.52,50.16 96.52,48.89 95.25,47.62 71.12,47.62 | U3.1 U3.14 | U6.27 U6.28 | U2.13 U2.14 | v20.32,94.62 20.32,93.34
  Top 0.381: U4.16 20.32,93.34 21.27,93.34 23.81,90.81 26.35,90.81 28.26,88.9 C11.1 43.41,88.03 U11.11 50.4,88.03 51.2,87.23 U11.33 58.19,87.23 C12.1
  Top 0.813: C1.1 7.62,36.2 | 7.62,36.2 C5.1 36.83,36.2 | 36.83,36.2 58.42,36.2 | 58.42,36.2 67.88,36.2 C8.1 68.01,36.2 69.85,36.2 71.12,37.46 U8.20 | C9.1 69.91,46.42 71.12,47.62 U9.20 | U5.20 36.83,36.2 | U1.20 7.62,36.2 | 58.42,36.2 58.42,35.88 | U6.28 C6.1
  Top 0.914: 58.42,35.88 v58.42,35.56
  Bottom 0.254: U5.1 U5.20 | U1.1 U1.20 | U4.11 12.7,80.65 | U4.10 12.7,78.11 | U4.9 12.7,75.56 | S2.7 S2.6 S2.5 S2.4 S2.3 S2.2 S2.1 97.79,78.11 99.06,76.84 99.06,71.76 R5.1 S1.2 S1.1 R4.1 | U10.18 76.2,84.45 76.2,81.92 U10.20 | 8.89,64.14 8.89,67.95 U3.1 | 8.89,64.14 8.89,60.32 U3.5 | U3.3 8.89,64.14 | U3.13 U3.14 | U7.1 49.53,17.14 49.53,20.96 | R2.2 v20.32,94.62
  Bottom 0.406: v58.42,35.56 58.42,30.48 55.24,27.3 54.61,27.3 U7.20
  Bottom 0.813: C8.1 67.94,41.59 69.53,43.18 69.53,44.77 67.94,46.35 C9.1 67.94,53.97 | U9.20 RN3.1 | C13.+ 17.78,17.14 6.03,28.89 6.03,36.2 | C7.1 49.53,20.96 50.8,22.23 U7.20 | 6.03,36.2 C1.1 | 6.03,36.2 6.03,38.73 | 6.03,38.73 6.03,46.35 | C2.1 6.03,46.35 | 12.7,69.22 C3.1 12.7,75.56 12.7,78.11 12.7,80.65 12.7,93.34 | 12.7,93.34 C4.1 | U3.14 12.7,69.22 | 12.7,69.22 12.7,56.52 6.03,49.85 6.03,48.89 | U4.16 12.7,93.34 | C6.1 67.94,53.97 | 67.94,53.97 67.94,63.18 74.93,70.17 74.93,77.47 | 74.93,77.47 U10.20 | C10.1 74.93,77.47 | 6.03,46.35 6.03,48.89 | U2.14 6.03,48.89 | U1.20 6.03,38.73
  Bottom 1.524: P1.6 C13.+
A0  (via drill 0.5)
  Top 0.254: U11.1 39.54,96.03 38.42,97.16 v33.02,97.16
  Bottom 0.254: U1.14 35.56,51.43 35.56,61.59 36.83,62.86 U6.10 36.83,73.03 33.02,76.84 v33.02,97.16
A1  (via drill 0.5)
  Top 0.254: U11.2 39.39,95.23 38.42,96.2 v34.29,96.2
  Bottom 0.254: U1.13 25.4,40 38.1,52.7 38.1,61.59 39.37,62.86 U6.9 39.37,71.76 34.29,76.84 v34.29,96.2
A2  (via drill 0.5)
  Top 0.254: U11.3 39.24,94.43 38.42,95.25 v35.56,95.25
  Bottom 0.254: U1.12 40.64,51.43 40.64,61.59 41.91,62.86 U6.8 41.91,70.48 35.56,76.84 v35.56,95.25
A3  (via drill 0.5)
  Top 0.254: U11.5 38.62,92.83 v38.1,93.34
  Bottom 0.254: U1.11 43.18,51.43 43.18,61.59 44.45,62.86 U6.7 44.45,70.48 38.1,76.84 v38.1,93.34
A4  (via drill 0.5)
  Top 0.254: U11.18 40.84,82.43 v40.32,81.92
  Bottom 0.254: U5.18 41.91,40 45.72,43.81 45.72,61.59 46.99,62.86 U6.6 46.99,70.48 40.32,77.15 v40.32,81.92
A5  (via drill 0.5)
  Top 0.254: U11.20 43.05,80.83 v42.23,80.01
  Bottom 0.254: U5.17 44.45,40 48.26,43.81 48.26,61.59 49.53,62.86 U6.5 49.53,70.48 42.23,77.79 v42.23,80.01
A6  (via drill 0.5)
  Top 0.254: U11.22 v46.67,79.23
  Bottom 0.254: U5.16 46.99,40 50.8,43.81 50.8,61.59 52.07,62.86 U6.4 52.07,70.48 46.67,75.88 v46.67,79.23
A7  (via drill 0.5)
  Top 0.254: U11.23 52.56,79.23 v52.07,78.74
  Bottom 0.254: U5.15 49.53,40 53.34,43.81 53.34,61.59 54.61,62.86 U6.3 54.61,70.48 52.07,73.03 v52.07,78.74
A8  (via drill 0.5)
  Top 0.254: v55.88,52.7 53.34,52.7 U6.25 | U11.24 v51.12,80.03
  Bottom 0.254: U5.14 52.07,40 55.88,43.81 v55.88,52.7 | U6.25 52.07,61.59 53.34,62.86 53.34,70.48 51.12,72.71 v51.12,80.03
A9  (via drill 0.5)
  Top 0.254: v57.78,52.39 57.15,51.75 51.75,51.75 U6.24 | U11.21 44.15,80.03 v43.18,79.06
  Bottom 0.254: U5.13 54.61,40 57.78,43.18 v57.78,52.39 | U6.24 49.53,61.59 50.8,62.86 50.8,70.48 43.18,78.11 v43.18,79.06
A10  (via drill 0.5)
  Top 0.254: v59.05,51.12 58.42,50.48 45.4,50.48 U6.21 | U11.4 39.09,93.63 38.42,94.3 v36.83,94.3
  Bottom 0.254: U5.12 57.15,40 59.05,41.91 v59.05,51.12 | U6.21 41.91,61.59 43.18,62.86 43.18,70.48 36.83,76.84 v36.83,94.3
A11  (via drill 0.5)
  Top 0.254: v60.33,52.39 59.05,52.39 57.78,51.12 49.85,51.12 U6.23 | U11.19 41.94,81.63 v41.27,80.96
  Bottom 0.254: U5.11 59.69,40 60.33,40.64 v60.33,52.39 | U6.23 46.99,61.59 48.26,62.86 48.26,70.48 41.27,77.47 v41.27,80.96
A12  (via drill 0.5)
  Top 0.254: v61.59,68.58 60.96,67.95 58.42,67.95 U6.2 | U11.25 59.51,80.83 v61.59,78.74
  Bottom 0.254: U7.18 61.59,29.21 v61.59,68.58 62.23,69.22 62.23,78.11 v61.59,78.74
A13  (via drill 0.5)
  Top 0.254: U10.8 79.38,98.43 78.11,99.7 v61.59,99.7 | U11.26 60.61,81.63 v62.23,80.01
  Bottom 0.254: U7.17 62.23,27.3 62.23,67.95 62.87,68.58 62.87,79.38 v62.23,80.01 61.59,80.65 61.59,82.87 62.23,83.5 62.23,99.06 v61.59,99.7
A14  (via drill 0.5)
  Top 0.254: U10.11 v62.87,103.51 | U11.27 61.72,82.43 v62.87,81.28
  Bottom 0.254: U7.16 62.87,25.4 62.87,67.63 63.5,68.26 63.5,80.65 v62.87,81.28 62.23,81.92 62.23,82.55 62.87,83.19 v62.87,103.51
A15  (via drill 0.5)
  Top 0.254: U10.6 79.38,93.34 78.11,92.08 73.66,92.08 72.39,93.34 v63.82,93.34 | U11.28 62.82,83.23 v63.5,82.55
  Bottom 0.254: U7.15 63.5,67.31 64.14,67.95 64.14,81.92 v63.5,82.55 63.5,92.39 63.82,92.71 v63.82,93.34
A16  (via drill 0.5)
  Top 0.254: U10.13 v64.77,98.43 | U11.39 61.96,92.03 62.87,91.12 v64.77,91.12
  Bottom 0.254: U7.14 64.14,25.4 64.14,66.99 64.77,67.63 v64.77,91.12 v64.77,98.43
A17  (via drill 0.5)
  Top 0.254: U11.42 v65.72,94.43 | U10.4 79.38,88.27 78.11,89.54 v65.72,89.54
  Bottom 0.254: U7.13 64.77,27.3 64.77,66.67 65.41,67.31 65.41,81.92 65.72,82.23 v65.72,89.54 v65.72,94.43
A18  (via drill 0.5)
  Top 0.254: U10.15 73.66,93.34 71.44,95.57 v66.67,95.57 65.41,95.57 65.07,95.23 U11.43
  Bottom 0.254: U7.12 65.41,29.21 65.41,66.36 66.04,66.99 66.04,81.6 66.67,82.23 v66.67,95.57
A19  (via drill 0.5)
  Top 0.254: U10.2 79.38,83.19 78.11,84.45 v67.63,84.45 | U11.44 64.6,96.03 65.09,96.52 v67.63,96.52
  Bottom 0.254: U7.11 66.04,31.12 66.04,66.04 66.67,66.67 66.67,81.28 67.63,82.23 v67.63,84.45 v67.63,96.52
BA0
  Bottom 0.254: P1.22 38.1,8.26 36.51,9.84 36.51,14.92 U1.6
BA1  (via drill 0.5)
  Top 0.254: P1.23 40.64,8.26 v39.37,9.53
  Bottom 0.254: v39.37,9.53 37.47,11.43 37.47,15.24 23.5,29.21 23.5,30.48 U1.7
BA2
  Bottom 0.254: P1.24 40.64,9.53 38.42,11.75 38.42,15.56 25.4,28.57 U1.8
BA3  (via drill 0.5)
  Top 0.254: P1.25 43.18,8.26 v41.91,9.53
  Bottom 0.254: v41.91,9.53 39.37,12.07 39.37,15.88 27.94,27.3 U1.9
BA4
  Bottom 0.254: P1.26 43.18,10.16 40.32,13.02 40.32,30.16 U5.2
BA5  (via drill 0.5)
  Top 0.254: P1.27 45.72,8.26 v44.45,9.53
  Bottom 0.254: v44.45,9.53 44.45,10.16 41.27,13.34 41.27,30.48 U5.3
BA6
  Bottom 0.254: P1.28 45.72,10.16 42.23,13.65 42.23,28.89 U5.4
BA7  (via drill 0.5)
  Top 0.254: P1.29 48.26,8.26 v46.99,9.53
  Bottom 0.254: v46.99,9.53 46.99,10.16 43.18,13.97 43.18,27.3 U5.5
BA8
  Bottom 0.254: P1.30 48.26,10.16 44.13,14.29 44.13,25.72 U5.6
BA9  (via drill 0.5)
  Top 0.254: P1.31 50.8,8.26 v49.53,9.53
  Bottom 0.254: v49.53,9.53 49.53,10.16 45.09,14.61 45.09,24.13 U5.7
BA10
  Bottom 0.254: P1.32 50.8,10.16 45.72,15.24 45.72,22.86 52.7,29.85 53.34,29.85 U5.8
BA11  (via drill 0.5)
  Top 0.254: P1.33 53.34,8.26 v52.07,9.53
  Bottom 0.254: v52.07,9.53 52.07,10.16 46.35,15.88 46.35,21.59 53.34,28.57 54.61,28.57 U5.9
BA12
  Bottom 0.254: P1.34 U7.2
BA13  (via drill 0.5)
  Top 0.254: P1.35 55.88,8.26 v54.61,9.53
  Bottom 0.254: v54.61,9.53 54.61,14.61 U7.3
BA14
  Bottom 0.254: P1.36 55.88,13.34 U7.4
BA15  (via drill 0.5)
  Top 0.254: P1.37 58.42,8.26 v57.15,9.53
  Bottom 0.254: v57.15,9.53 57.15,12.07 U7.5
BA16
  Bottom 0.254: P1.38 58.42,10.79 U7.6
BA17  (via drill 0.5)
  Top 0.254: P1.39 60.96,8.26 v59.69,9.53
  Bottom 0.254: v59.69,9.53 U7.7
BA18
  Bottom 0.254: P1.40 60.96,9.53 66.04,14.61 67.31,14.61 U7.8
BA19  (via drill 0.5)
  Top 0.254: P1.41 63.5,8.26 v62.23,9.53
  Bottom 0.254: v62.23,9.53 66.67,13.97 68.58,13.97 69.85,15.24 70.48,15.24 U7.9
BD0  (via drill 0.5)
  Top 0.254: P1.43 66.04,8.26 66.67,8.89 v67.31,8.89
  Bottom 0.254: v67.31,8.89 71.44,13.02 74.61,13.02 80.01,18.41 80.01,27.3 RN2.2
BD1
  Bottom 0.254: P1.44 66.04,8.89 70.8,13.65 73.66,13.65 78.74,18.73 RN1.2
BD2  (via drill 0.5)
  Top 0.254: P1.45 68.58,8.26 69.22,8.89 v69.85,8.89
  Bottom 0.254: v69.85,8.89 72.71,11.75 76.52,11.75 85.09,20.32 85.09,27.3 RN2.4
BD3
  Bottom 0.254: P1.46 68.58,8.89 72.07,12.38 75.56,12.38 83.82,20.64 RN1.4
BD4  (via drill 0.5)
  Top 0.254: P1.47 71.12,8.26 71.75,8.89 v72.39,8.89
  Bottom 0.254: v72.39,8.89 73.98,10.48 78.42,10.48 90.17,22.23 90.17,27.3 RN2.6
BD5
  Bottom 0.254: P1.48 71.12,8.89 73.34,11.11 77.47,11.11 88.9,22.54 RN1.6
BD6  (via drill 0.5)
  Top 0.254: P1.49 73.66,8.26 74.3,8.89 v74.93,8.89
  Bottom 0.254: v74.93,8.89 80.01,8.89 95.25,24.13 95.25,27.3 RN2.8
BD7
  Bottom 0.254: P1.50 73.66,9.21 74.3,9.84 79.38,9.84 93.98,24.45 RN1.8
CGND1  (via drill 4.06 pad 6.35)
  other vias: 96.52,12.7
CGND2  (via drill 4.06 pad 6.35)
  other vias: 96.52,104.14
D0  (via drill 0.5)
  Top 0.254: v76.2,67.95 75.56,67.31 36.2,67.31 U6.11 | v34.29,73.03 34.92,73.66 53.98,73.66 v54.61,74.3 | U11.32 55,86.43 v54.61,86.04
  Bottom 0.254: U9.18 RN3.2 v76.2,67.95 | U6.11 v34.29,73.03 | v54.61,74.3 v54.61,86.04
D1  (via drill 0.5)
  Top 0.254: v77.47,67.31 76.83,66.67 34.29,66.67 U6.12 | U11.14 44.51,85.63 43.34,84.45 v31.75,84.45
  Bottom 0.254: U9.17 RN3.3 78.74,53.34 77.47,54.61 v77.47,67.31 | U6.12 v31.75,84.45
D2  (via drill 0.5)
  Top 0.254: v78.74,66.67 78.11,66.04 32.38,66.04 U6.13 | U11.10 44.2,88.83 42.55,90.49 30.16,90.49 29.84,90.17 v29.21,90.17
  Bottom 0.254: U9.16 RN3.4 81.28,53.34 78.74,55.88 v78.74,66.67 | U6.13 v29.21,90.17
D3  (via drill 0.5)
  Top 0.254: v83.82,60.96 83.19,60.32 27.3,60.32 v26.67,59.69 | U11.9 44.35,89.63 42.86,91.12 v27.94,91.12
  Bottom 0.254: U9.15 RN3.5 v83.82,60.96 | U6.15 v26.67,59.69 26.67,61.59 27.94,62.86 v27.94,91.12
D4  (via drill 0.5)
  Top 0.254: v86.36,60.32 85.72,59.69 29.84,59.69 v29.21,59.05 | U11.13 44.36,86.43 43.02,85.09 32.7,85.09 32.07,85.73 v30.48,85.73
  Bottom 0.254: U9.14 RN3.6 v86.36,60.32 | U6.16 v29.21,59.05 29.21,61.59 30.48,62.86 v30.48,85.73
D5  (via drill 0.5)
  Top 0.254: v88.9,59.69 88.27,59.05 32.38,59.05 v31.75,58.42 | v33.02,73.66 33.66,74.3 52.7,74.3 v53.34,74.93 | U11.31 55.47,85.63 54.93,85.09 v53.34,85.09
  Bottom 0.254: U9.13 RN3.7 v88.9,59.69 | U6.17 v31.75,58.42 31.75,61.59 33.02,62.86 v33.02,73.66 | v53.34,85.09 v53.34,74.93
D6  (via drill 0.5)
  Top 0.254: v91.44,59.05 90.81,58.42 34.92,58.42 v34.29,57.78 | v35.56,72.39 36.2,73.03 59.05,73.03 v59.69,73.66 | U11.35 57.24,88.83 58.58,90.17 v60.33,90.17
  Bottom 0.254: U9.12 RN3.8 v91.44,59.05 | U6.18 v34.29,57.78 34.29,61.59 35.56,62.86 v35.56,72.39 | v60.33,90.17 60.33,83.82 59.69,83.19 v59.69,73.66
D7  (via drill 0.5)
  Top 0.254: v93.98,58.42 93.34,57.78 37.47,57.78 v36.83,57.15 | v37.78,72.07 38.42,72.07 38.73,72.39 60.33,72.39 v60.96,73.03 | U11.36 57.09,89.63 58.58,91.12 v61.28,91.12
  Bottom 0.254: U9.11 RN3.9 v93.98,58.42 | U6.19 v36.83,57.15 36.83,61.59 38.1,62.86 38.1,71.12 37.78,71.44 v37.78,72.07 | v61.28,91.12 61.28,83.82 60.33,82.87 60.33,76.52 60.96,75.88 v60.96,73.03
LOGO-C
  pour Top (no thermals): 16.9,108.39 16.74,107.71 13.74,107.71 13.26,105.83 16.24,105.83 16.07,105.14 12.78,105.14 arc-47 12.52,105.25 arc-36 12.38,105.57 arc-17 12.39,105.83 arc-5 12.41,105.98 12.82,107.56 arc-33 13.18,108.16 arc-31 13.56,108.38 arc-13 13.7,108.39
LOGO-I
  pour Top (no thermals): 11.52,108.39 12.4,108.39 11.55,105.14 10.68,105.14
LOGO-M
  pour Top (no thermals): 5.12,105.14 5.96,108.39 10.24,108.39 arc-50 10.58,108.27 arc-37 10.71,107.98 arc-17 10.68,107.6 10.04,105.14 9.16,105.14 9.83,107.71 8.69,107.71 8.03,105.14 7.14,105.14 7.81,107.71 6.67,107.71 6.01,105.14
LOGO-O
  pour Top (no thermals): 22.78,107.71 24.88,107.71 24.38,105.83 22.26,105.83 22.76,107.71 22.81,108.39 22.7,108.39 arc33 22.31,108.26 arc19 22.02,107.94 arc18 21.85,107.56 21.42,105.96 arc9 21.4,105.86 arc9 21.39,105.62 arc22 21.44,105.41 arc36 21.56,105.23 arc17 21.69,105.16 arc13 21.83,105.14 24.4,105.14 arc18 24.61,105.16 arc16 24.8,105.26 arc14 25.03,105.48 arc26 25.29,105.94 25.72,107.62 arc17 25.74,107.9 arc19 25.7,108.12 arc66 25.32,108.39 22.83,108.39
LOGO-R
  pour Top (no thermals): 17.55,108.39 18.25,107.71 18.08,107 20.19,107 20.36,107.71 18.28,107.71 17.58,108.39 20.71,108.39 arc-55 21.13,108.19 arc-31 21.24,107.93 arc-18 21.21,107.6 21.1,107.19 arc-18 21.02,107.01 arc-18 20.7,106.61 arc-19 20.39,106.41 arc-14 20.04,106.35 20.48,105.14 19.6,105.14 19.17,106.36 17.89,106.36 17.58,105.14 16.7,105.14
LOGO-X
  pour Top (no thermals): 0.83,105.14 1.81,105.14 2.92,106.17 3.49,105.14 4.53,105.14 3.59,106.77 5.37,108.39 4.38,108.39 3.26,107.36 2.69,108.39 1.66,108.39 2.59,106.74
N$1
  Top 0.254: U8.18 77.47,37.46 80.01,37.46 U8.16 U8.15 U8.14 U8.13 U8.12 U8.11 R3.2
N$2
  Top 0.254: U8.17 80.01,40 96.52,40 R4.2
N$5
  Top 0.254: JP2.1 U10.19
N$6  (via drill 0.5)
  Top 0.254: v10.16,34.92 v26.67,34.92 | v33.66,46.35 v21.59,46.35
  Bottom 0.254: R1.2 20.32,51.43 21.59,50.16 v21.59,46.35 | Q1.2 21.59,13.97 21.59,20 11.43,30.16 11.43,33.66 v10.16,34.92 | v26.67,34.92 26.67,39.37 v33.66,46.35
N$9
  Bottom 0.254: JP1.1 Q1.3
N$12  (via drill 0.5)
  Top 0.254: v54.61,61.28 55.56,61.28 55.88,60.96 82.55,60.96 83.5,61.91 v88.27,61.91
  Bottom 0.254: U6.26 v54.61,61.28 | R7.2 95.25,73.03 95.25,71.76 S1.3 88.27,64.77 v88.27,61.91
N$16
  Bottom 0.254: U3.8 16.51,55.24 16.51,60.32 U3.11
N$17
  Top 0.254: S1.4 84.77,69.53 60.96,69.53 60.64,69.22 U6.1
  Bottom 0.254: S1.4 96.52,70.48 96.52,71.76 R6.2
N$27  (via drill 0.5)
  Top 0.254: v21.59,80.01 26.04,75.56 51.75,75.56 52.7,76.52 54.29,76.52 54.61,76.2 v82.55,76.2
  Bottom 0.254: U2.11 15.24,50.16 17.78,52.7 17.78,76.2 v21.59,80.01 | v82.55,76.2 U10.1
N$31
  Top 0.254: U4.15 C14.1 R2.1
N$32
  Top 0.254: U2.8 68.58,48.89 69.85,50.16 72.39,50.16 U9.19
N$37
  Bottom 0.254: U9.2 74.93,40 74.93,35.56 73.66,34.29 U8.2 RN2.1
N$38
  Bottom 0.254: U9.3 77.47,40 77.47,35.56 76.2,34.29 U8.3 77.47,29.85 77.47,27.3 RN1.1
N$39
  Bottom 0.254: U9.4 80.01,40 80.01,35.56 78.74,34.29 U8.4 RN2.3
N$40
  Bottom 0.254: U9.5 82.55,40 82.55,35.56 81.28,34.29 U8.5 82.55,29.85 82.55,27.3 RN1.3
N$41
  Bottom 0.254: U9.6 85.09,40 85.09,35.56 83.82,34.29 U8.6 RN2.5
N$42
  Bottom 0.254: U9.7 87.63,40 87.63,35.56 86.36,34.29 U8.7 87.63,29.85 87.63,27.3 RN1.5
N$43
  Bottom 0.254: U9.8 90.17,40 90.17,35.56 88.9,34.29 U8.8 RN2.7
N$44
  Bottom 0.254: U9.9 92.71,40 92.71,35.56 91.44,34.29 U8.9 92.71,29.85 92.71,27.3 RN1.7
N$45  (via drill 0.5)
  Top 0.254: U11.6 v25.72,92.03
  Bottom 0.254: U2.3 12.7,44.45 13.97,45.72 13.97,50.8 17.14,53.97 17.14,78.74 25.72,87.31 v25.72,92.03
RWCYCLE  (via drill 0.5)
  Top 0.254: v19.37,73.98 v5.08,73.98
  Bottom 0.254: U2.6 20.32,44.45 19.05,45.72 19.05,72.71 19.37,73.03 v19.37,73.98 | v5.08,73.98 TP1.1 U4.2
SW1_A19
  Top 0.254: U10.3 RN4.2 S2.14
SW2_A18
  Top 0.254: U10.16 78.11,90.81 79.38,89.54 83.82,89.54 RN4.3 S2.13
SW3_A17
  Top 0.254: U10.5 RN4.4 S2.12
SW4_A16
  Top 0.254: U10.14 78.11,95.89 79.38,94.62 83.82,94.62 RN4.5 S2.11
SW5_A15
  Top 0.254: U10.7 RN4.6 S2.10
SW6_A14
  Top 0.254: U10.12 78.11,100.97 79.38,99.7 83.82,99.7 RN4.7 S2.9
SW7_A13
  Top 0.254: U10.9 RN4.8 S2.8
WAIT_ROM
  Top 0.254: U4.13 R1.1
  Bottom 0.254: TP3.1 20.32,87 R1.1

### Text on the board
tPlace: A13 | ROM ADDRESS | A19 | ROM / ENABLE | 0 | ROM / PAGE | 1 | ROM / WAIT
tNames: XMICRO-MEMORY | V1.0 2411 | JLCJLCJLCJLC | CHRIS WEIR / ID $02